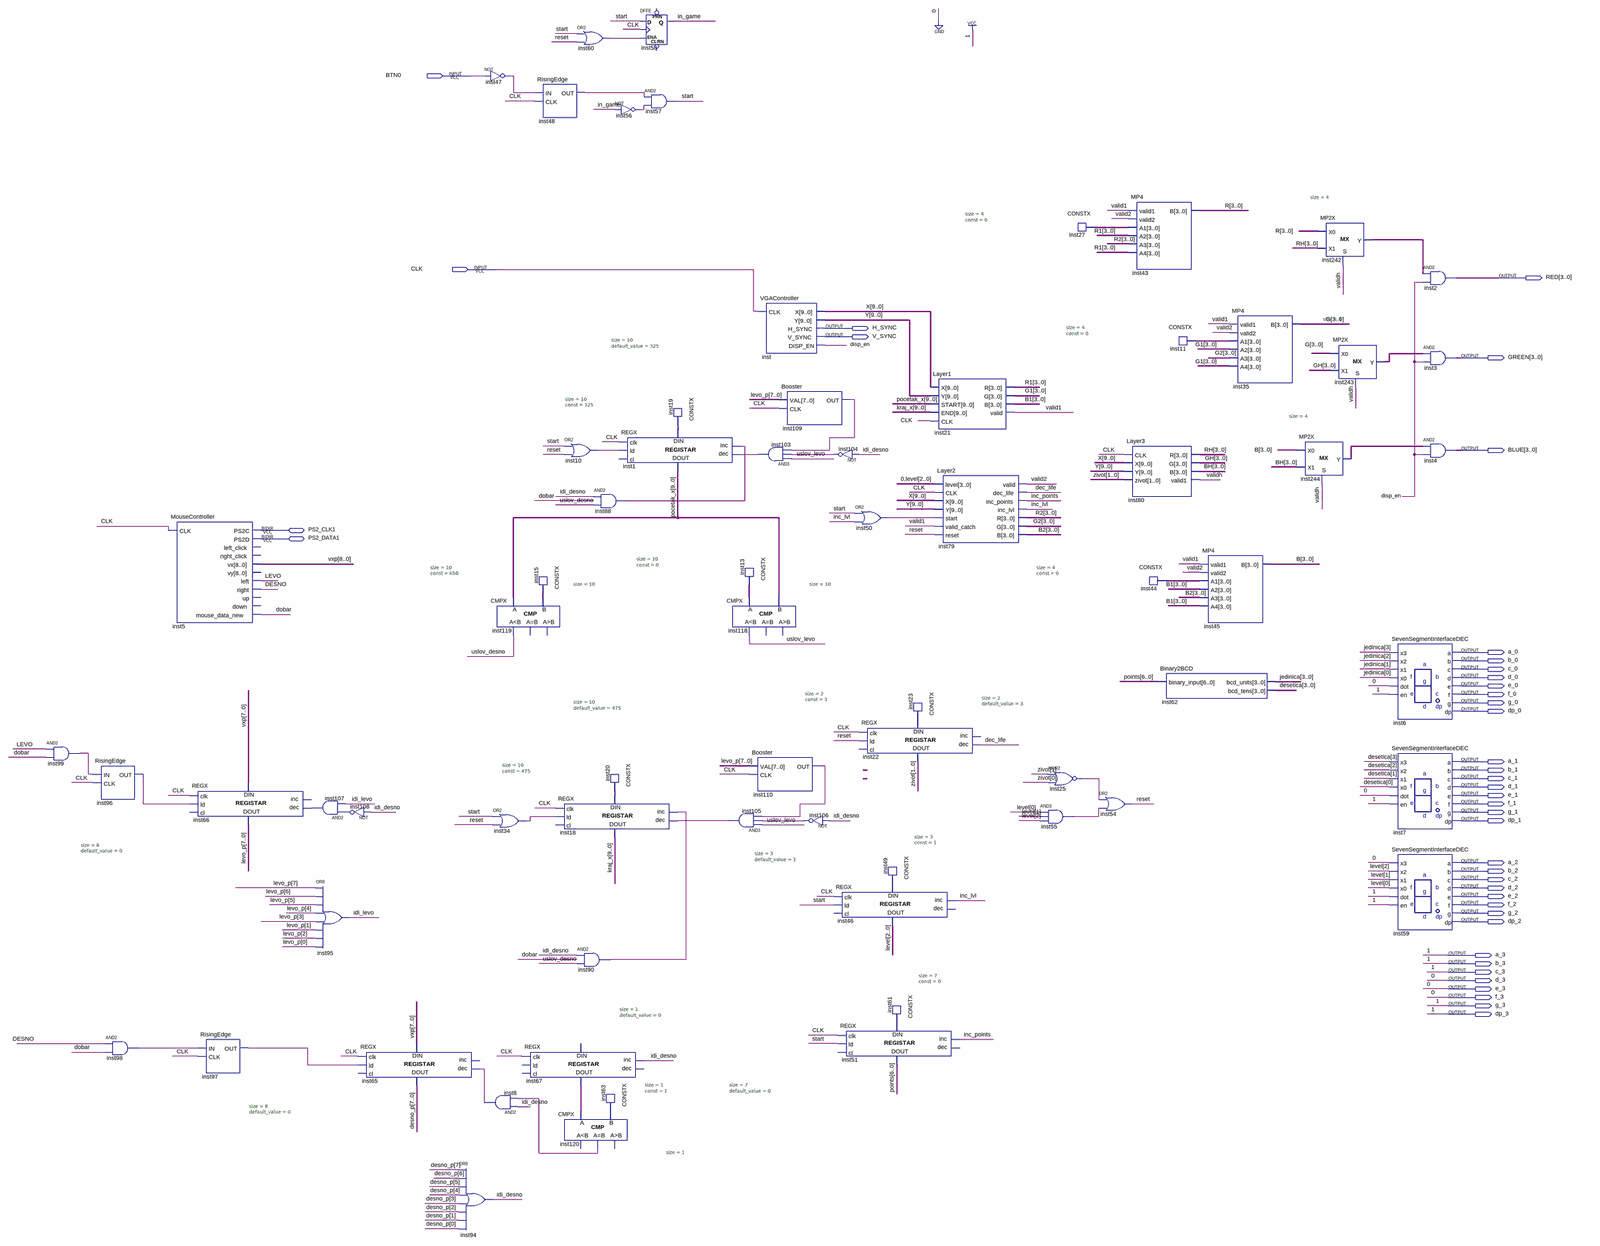
[diagram p0: schematic sheet, whole]
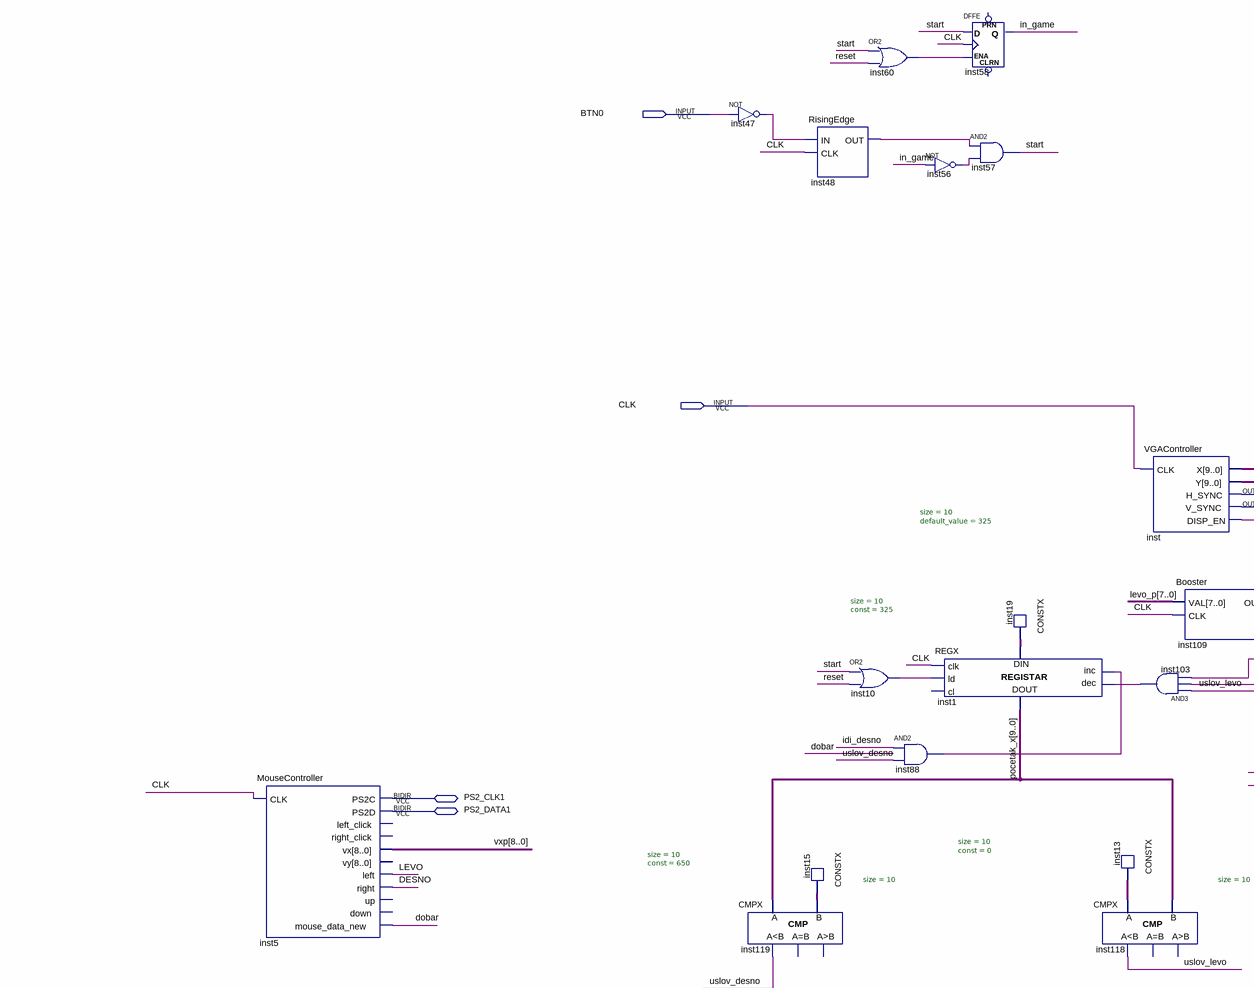
[diagram p1: schematic sheet, upper left part]
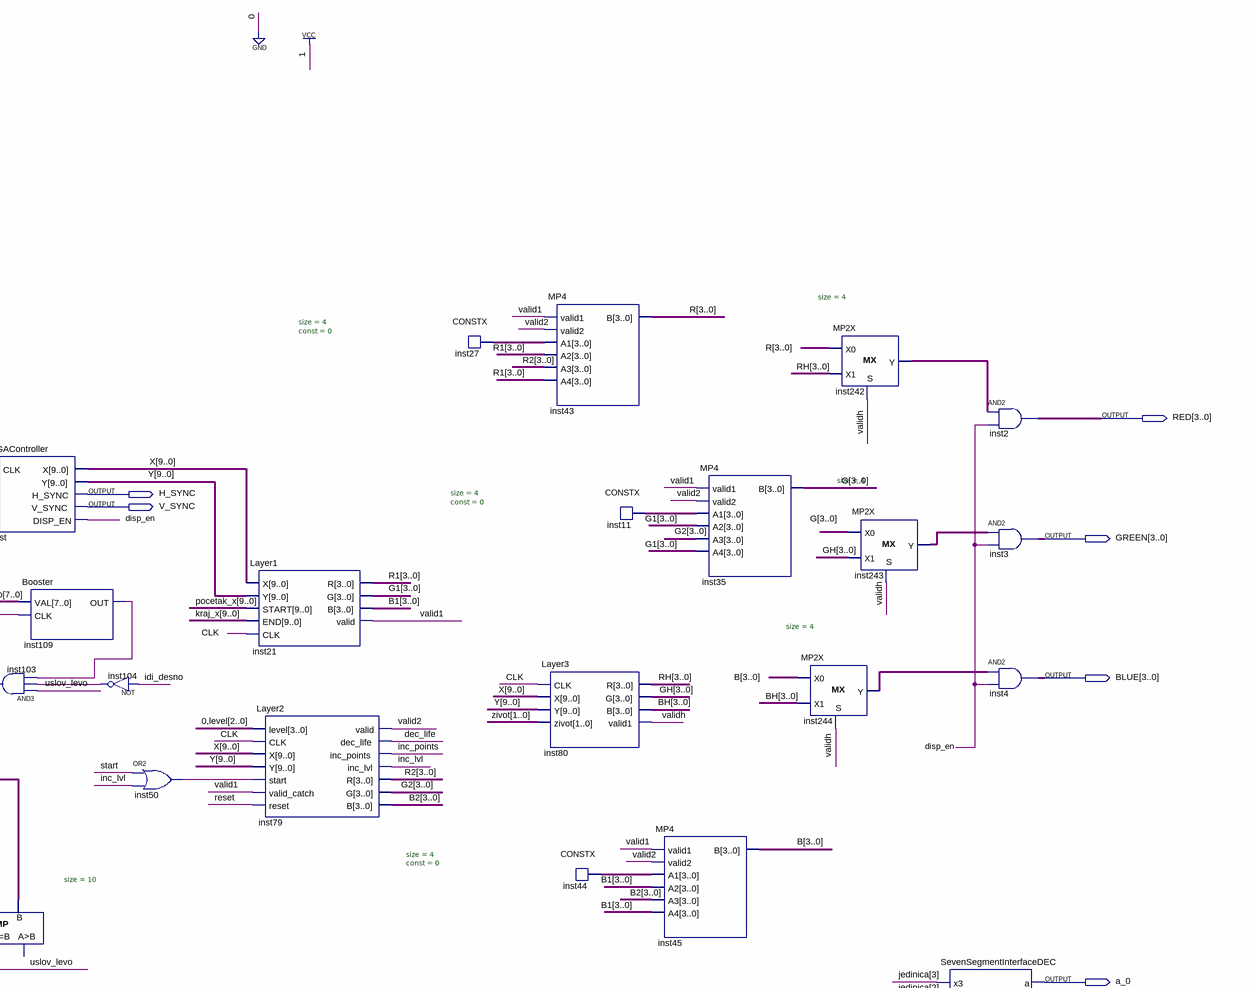
[diagram p2: schematic sheet, upper right part]
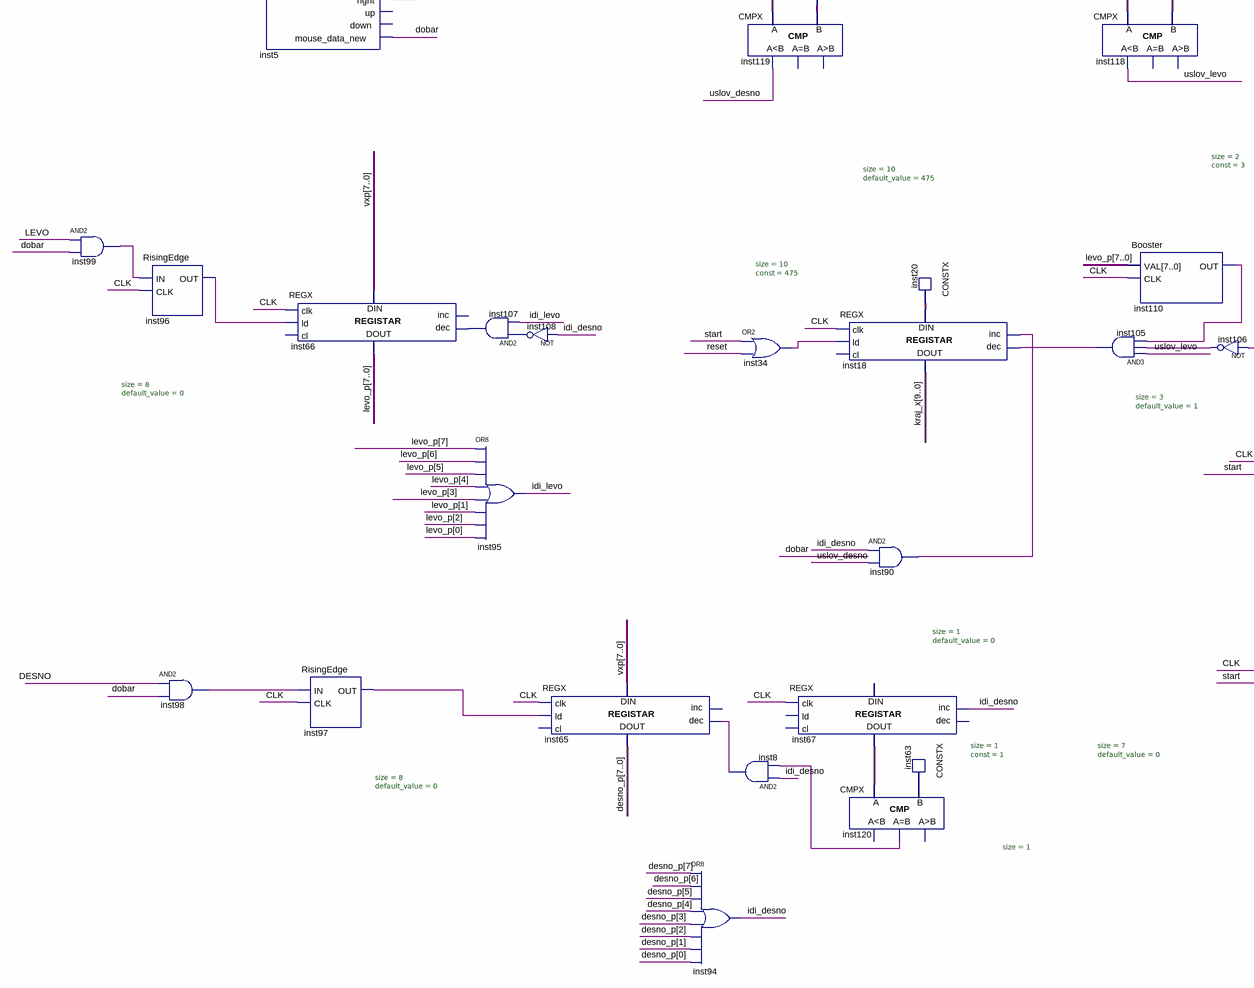
[diagram p3: schematic sheet, lower left part]
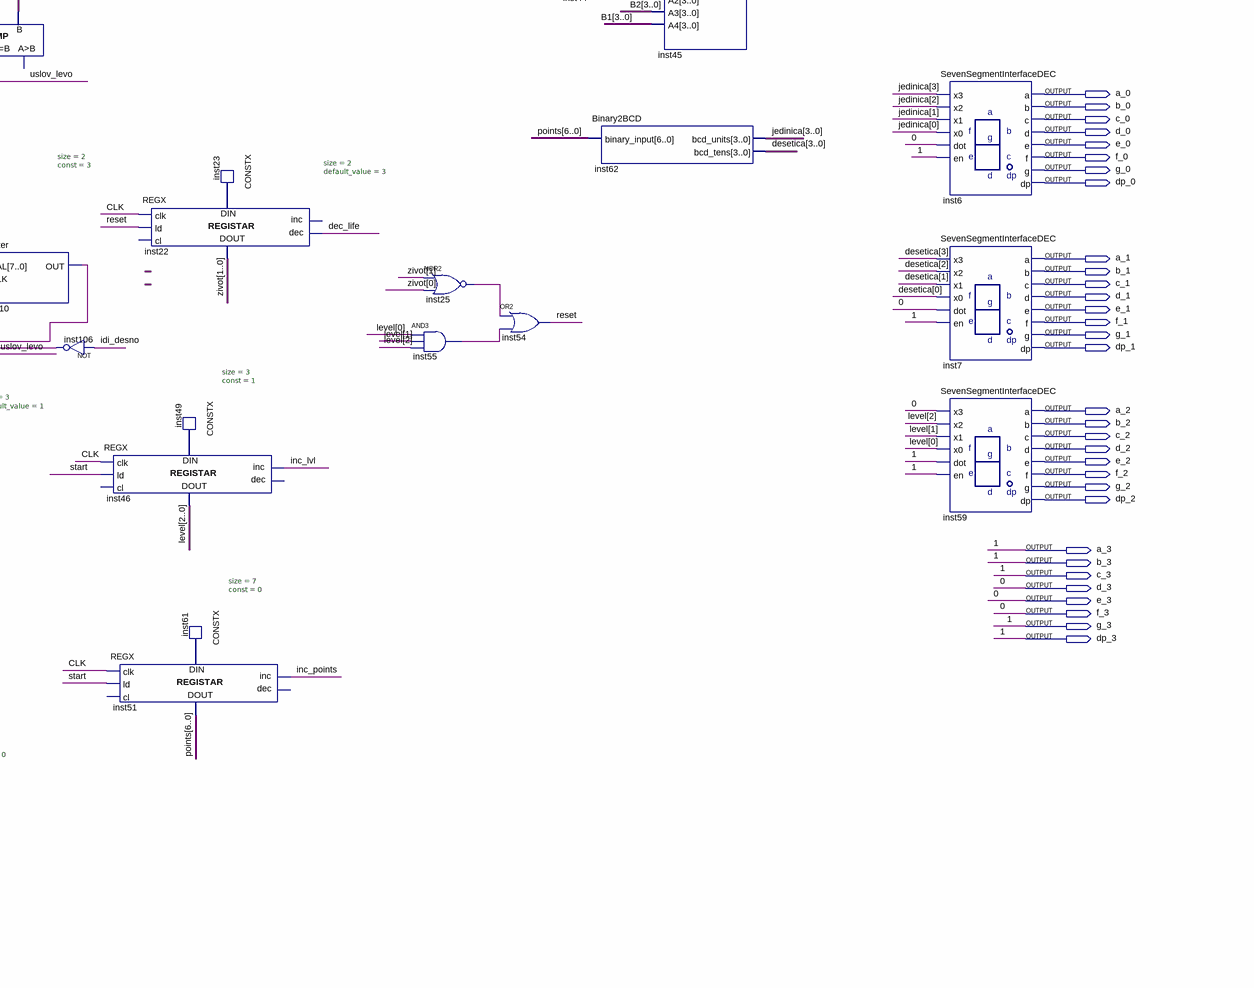
[diagram p4: schematic sheet, lower right part]
// Quartus schematic main.bdf as structural Verilog: 69 symbols, 41 pins
module main (
  input  BTN0,
  input  CLK,
  inout  PS2_CLK1,
  inout  PS2_DATA1,
  output [3:0] RED,
  output H_SYNC,
  output V_SYNC,
  output [3:0] GREEN,
  output [3:0] BLUE,
  output a_0,
  output b_0,
  output c_0,
  output d_0,
  output e_0,
  output f_0,
  output g_0,
  output dp_0,
  output a_1,
  output b_1,
  output c_1,
  output d_1,
  output e_1,
  output f_1,
  output g_1,
  output dp_1,
  output a_2,
  output b_2,
  output c_2,
  output d_2,
  output e_2,
  output f_2,
  output g_2,
  output dp_2,
  output a_3,
  output b_3,
  output c_3,
  output d_3,
  output e_3,
  output f_3,
  output g_3,
  output dp_3
);

  wire dec_life, DESNO, disp_en, dobar, idi_desno, idi_levo, in_game, inc_lvl, inc_points, inst8_out,
       inst10_out, inst25_out, inst34_out, inst47_out, inst48_out, inst50_out, inst55_out, inst56_out,
       inst60_out, inst63_data, inst67_data_out, inst88_out, inst90_out, inst96_out, inst97_out, inst98_out,
       inst99_out, inst103_out, inst104_out, inst105_out, inst106_out, inst107_out, inst108_out, inst109_out,
       inst110_out, inst120_eq, LEVO, reset, start, uslov_desno, uslov_levo, valid1, valid2, validh;
  wire [1:0] inst23_data, zivot;
  wire [2:0] inst49_data, level;
  wire [3:0] B, B1, B2, BH, desetica, G, G1, G2, GH, inst11_data, inst27_data, inst44_data, inst242_y,
       inst243_y, inst244_y, jedinica, R, R1, R2, RH;
  wire [6:0] inst61_data, points;
  wire [7:0] desno_p, levo_p;
  wire [8:0] vxp;
  wire [9:0] inst13_data, inst15_data, inst19_data, inst20_data, kraj_x, pocetak_x, X, Y;

  and inst99 (inst99_out, LEVO, dobar);
  RisingEdge inst96 (.IN(inst99_out), .CLK(CLK), .OUT(inst96_out));
  and inst98 (inst98_out, DESNO, dobar);
  MouseController inst5 (
    .CLK(CLK), .vx(vxp), .left(LEVO), .right(DESNO), .mouse_data_new(dobar), .PS2C(PS2_CLK1), .PS2D(PS2_DATA1));  // open: left_click, right_click, vy, up, down
  REGX #(.size(8), .default_value(0)) inst66 (
    .clk(CLK), .ld(inst96_out), .dec(inst107_out), .data_in(vxp[7:0]), .data_out(levo_p));  // open: cl, inc
  RisingEdge inst97 (.IN(inst98_out), .CLK(CLK), .OUT(inst97_out));
  and inst107 (inst107_out, inst108_out, idi_levo);
  or inst95 (idi_levo, levo_p[7], levo_p[6], levo_p[5], levo_p[4], levo_p[3], levo_p[1], levo_p[2], levo_p[0]);
  not inst108 (inst108_out, idi_desno);
  REGX #(.size(8), .default_value(0)) inst65 (
    .clk(CLK), .ld(inst97_out), .dec(inst8_out), .data_in(vxp[7:0]), .data_out(desno_p));  // open: cl, inc
  or inst94 (idi_desno, desno_p[7], desno_p[6], desno_p[5], desno_p[4], desno_p[3], desno_p[2], desno_p[1], desno_p[0]);
  not inst47 (inst47_out, BTN0);
  CMPX #(.size(10)) inst119 (.A(pocetak_x), .B(inst15_data), .ls(uslov_desno));  // open: eq, gr
  or inst34 (inst34_out, start, reset);
  and inst8 (inst8_out, idi_desno, inst120_eq);
  REGX #(.size(1), .default_value(0)) inst67 (
    .clk(CLK), .inc(idi_desno), .data_out(inst67_data_out));  // open: ld, cl, dec, data_in
  RisingEdge inst48 (.IN(inst47_out), .CLK(CLK), .OUT(inst48_out));
  CONSTX #(.size(10), .\const (650)) inst15 (.data(inst15_data));
  REGX #(.size(10), .default_value(475)) inst18 (
    .clk(CLK), .ld(inst34_out), .inc(inst90_out), .dec(inst105_out), .data_in(inst20_data), .data_out(kraj_x));  // open: cl
  CMPX #(.size(1)) inst120 (.A(inst67_data_out), .B(inst63_data), .eq(inst120_eq));  // open: ls, gr
  or inst60 (inst60_out, start, reset);
  or inst10 (inst10_out, start, reset);
  and inst88 (inst88_out, idi_desno, uslov_desno);
  and inst90 (inst90_out, idi_desno, uslov_desno);
  not inst56 (inst56_out, in_game);
  REGX #(.size(10), .default_value(325)) inst1 (
    .clk(CLK), .ld(inst10_out), .inc(inst88_out), .dec(inst103_out), .data_in(inst19_data),
    .data_out(pocetak_x));  // open: cl
  CONSTX #(.size(10), .\const (475)) inst20 (.data(inst20_data));
  CONSTX #(.size(1), .\const (1)) inst63 (.data(inst63_data));
  DFFE inst58 (.D(start), .CLK(CLK), .ENA(inst60_out), .Q(in_game));  // open: PRN, CLRN
  and inst57 (start, inst48_out, inst56_out);
  CONSTX #(.size(10), .\const (325)) inst19 (.data(inst19_data));
  CMPX #(.size(10)) inst118 (.A(inst13_data), .B(pocetak_x), .ls(uslov_levo));  // open: eq, gr
  and inst105 (inst105_out, uslov_levo, inst106_out, inst110_out);
  VGAController inst (.CLK(CLK), .X(X), .Y(Y), .H_SYNC(H_SYNC), .V_SYNC(V_SYNC), .DISP_EN(disp_en));
  and inst103 (inst103_out, uslov_levo, inst104_out, inst109_out);
  CONSTX #(.size(10), .\const (0)) inst13 (.data(inst13_data));
  Booster inst110 (.VAL(levo_p), .CLK(CLK), .OUT(inst110_out));
  Booster inst109 (.VAL(levo_p), .CLK(CLK), .OUT(inst109_out));
  not inst106 (inst106_out, idi_desno);
  not inst104 (inst104_out, idi_desno);
  or inst50 (inst50_out, start, inc_lvl);
  REGX #(.size(2), .default_value(3)) inst22 (
    .clk(CLK), .ld(reset), .dec(dec_life), .data_in(inst23_data), .data_out(zivot));  // open: cl, inc
  REGX #(.size(3), .default_value(1)) inst46 (
    .clk(CLK), .ld(start), .inc(inc_lvl), .data_in(inst49_data), .data_out(level));  // open: cl, dec
  REGX #(.size(7), .default_value(0)) inst51 (
    .clk(CLK), .ld(start), .inc(inc_points), .data_in(inst61_data), .data_out(points));  // open: cl, dec
  CONSTX #(.size(3), .\const (1)) inst49 (.data(inst49_data));
  CONSTX #(.size(7), .\const (0)) inst61 (.data(inst61_data));
  Layer1 inst21 (.X(X), .Y(Y), .START(pocetak_x), .END(kraj_x), .CLK(CLK), .R(R1), .G(G1), .B(B1), .valid(valid1));
  CONSTX #(.size(2), .\const (3)) inst23 (.data(inst23_data));
  Layer2 inst79 (
    .level({1'b0, level}), .CLK(CLK), .X(X), .Y(Y), .start(inst50_out), .valid_catch(valid1), .reset(reset),
    .valid(valid2), .dec_life(dec_life), .inc_points(inc_points), .inc_lvl(inc_lvl), .R(R2), .G(G2), .B(B2));
  CONSTX #(.size(4), .\const (0)) inst27 (.data(inst27_data));
  nor inst25 (inst25_out, zivot[1], zivot[0]);
  and inst55 (inst55_out, level[0], level[1], level[2]);
  or inst54 (reset, inst25_out, inst55_out);
  MP4 inst43 (.valid1(valid1), .valid2(valid2), .A1(inst27_data), .A2(R1), .A3(R2), .A4(R1), .B(R));
  Layer3 inst80 (.CLK(CLK), .X(X), .Y(Y), .zivot(zivot), .R(RH), .G(GH), .B(BH), .valid1(validh));
  CONSTX #(.size(4), .\const (0)) inst11 (.data(inst11_data));
  CONSTX #(.size(4), .\const (0)) inst44 (.data(inst44_data));
  Binary2BCD inst62 (.binary_input(points), .bcd_units(jedinica), .bcd_tens(desetica));
  MP4 inst45 (.valid1(valid1), .valid2(valid2), .A1(inst44_data), .A2(B1), .A3(B2), .A4(B1), .B(B));
  MP4 inst35 (.valid1(valid1), .valid2(valid2), .A1(inst11_data), .A2(G1), .A3(G2), .A4(G1), .B(G));
  MP2X #(.size(4)) inst244 (.S(validh), .X0(B), .X1(BH), .Y(inst244_y));
  MP2X #(.size(4)) inst242 (.S(validh), .X0(R), .X1(RH), .Y(inst242_y));
  MP2X #(.size(4)) inst243 (.S(validh), .X0(G), .X1(GH), .Y(inst243_y));
  SevenSegmentInterfaceDEC inst6 (
    .x3(jedinica[3]), .x2(jedinica[2]), .x1(jedinica[1]), .x0(jedinica[0]), .dot(1'b0), .en(1'b1), .a(a_0),
    .b(b_0), .c(c_0), .d(d_0), .e(e_0), .f(f_0), .g(g_0), .dp(dp_0));
  SevenSegmentInterfaceDEC inst7 (
    .x3(desetica[3]), .x2(desetica[2]), .x1(desetica[1]), .x0(desetica[0]), .dot(1'b0), .en(1'b1), .a(a_1),
    .b(b_1), .c(c_1), .d(d_1), .e(e_1), .f(f_1), .g(g_1), .dp(dp_1));
  SevenSegmentInterfaceDEC inst59 (
    .x3(1'b0), .x2(level[2]), .x1(level[1]), .x0(level[0]), .dot(1'b1), .en(1'b1), .a(a_2), .b(b_2), .c(c_2),
    .d(d_2), .e(e_2), .f(f_2), .g(g_2), .dp(dp_2));
  assign RED = inst242_y & {4{disp_en}};  // AND2 inst2, 4 bits wide
  assign GREEN = inst243_y & {4{disp_en}};  // AND2 inst3, 4 bits wide
  assign BLUE = inst244_y & {4{disp_en}};  // AND2 inst4, 4 bits wide

  assign a_3 = 1'b1;
  assign b_3 = 1'b1;
  assign c_3 = 1'b1;
  assign d_3 = 1'b0;
  assign dp_3 = 1'b1;
  assign e_3 = 1'b0;
  assign f_3 = 1'b0;
  assign g_3 = 1'b1;
endmodule
